# Altium schematic sheet Peripherals.SchDoc
size A; SheetNumber: 4; SheetTotal: 6
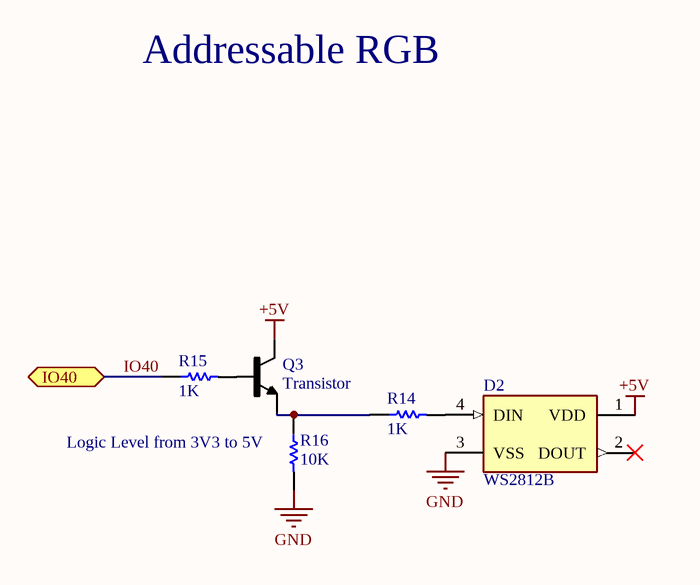
[diagram p0: Peripherals.SchDoc]

## Parts
D2  WS2812B  [WS28128B]
Q3  Transistor  [Transistor]
R14  1K  [R0402]
R15  1K  [R0402]
R16  10K  [R0402]

## Ports
IO40 (bidir, see Sheet1[4B], Connectors[4B], MCU Module[3C])

## Nets
+5V: D2.1(VDD) Q3.3(C)
GND: D2.3(VSS) R16.01
IO40: R15.02 ; port IO40
NetD2_4: D2.4(DIN) R14.01
NetQ3_1: Q3.1(B) R15.01
NetQ3_2: Q3.2(E) R14.02 R16.02

Not connected (* = marked no-connect by the designer): D2 2(DOUT)*

## Notes on the sheet
- Addressable RGB
- (near R16) Logic Level from 3V3 to 5V

## Library data of the parts
D2 = WS2812B: Intelligent control LED integrated light source
R14-R16 = Res